# EasyEDA Pro project ProPrj_宽带运放系列_2025-07-18.epro

# Schematic Schematic1
Board Name: 反相放大器; Create Date: 2025-07-18; Page Name: P1; Project Name: 宽带运放系列; Schematic Name: Schematic1; Update Date: 2025-07-18; Company: 嘉立创EDA; Page Size: A4; Version: V1.0
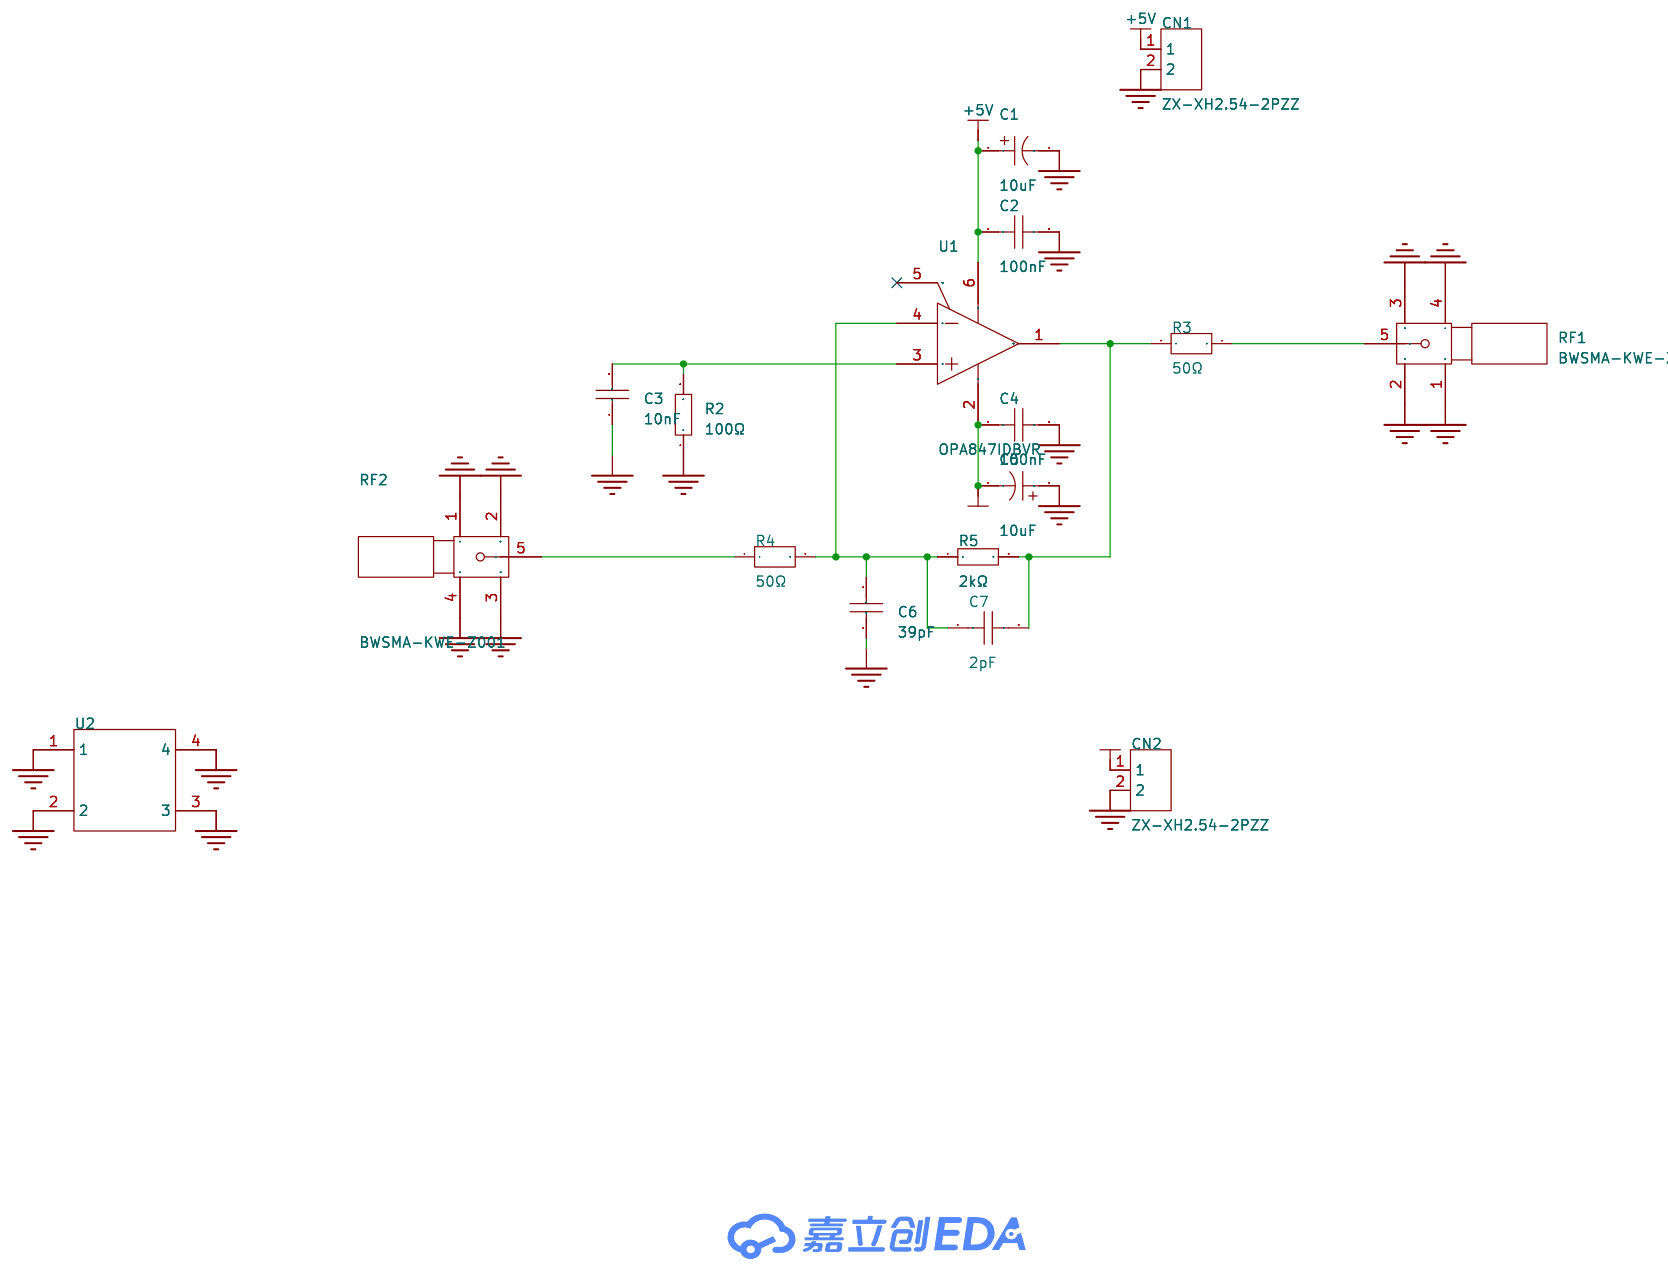
[diagram p0: schematic sheet]

## Parts
C1  10uF  [CAP-SMD_BD5.0-L5.3-W5.3-LS6.0-FD]
C2  100nF  [C0603]
C3  10nF  [C0603]
C4  100nF  [C0603]
C5  10uF  [CAP-SMD_BD5.0-L5.3-W5.3-LS6.0-FD]
C6  39pF  [C0603]
C7  2pF  [C0603]
CN1  ZX-XH2.54-2PZZ  [CONN-TH_2P-P2.50_HX25003-2A]
CN2  ZX-XH2.54-2PZZ  [CONN-TH_2P-P2.50_HX25003-2A]
R2  100Ω  [R0603]
R3  50Ω  [R0603]
R4  50Ω  [R0603]
R5  2kΩ  [R0603]
RF1  BWSMA-KWE-Z001  [SMA-TH_BWSMA-KWE-Z001]
RF2  BWSMA-KWE-Z001  [SMA-TH_BWSMA-KWE-Z001]
U1  OPA847IDBVR  [SOT-23-6_L2.9-W1.6-P0.95-LS2.8-BL]
U2  -  [22x17x6]

## Library data of the parts
C1 C5 = JVJ50v10M5x5: 容值:10uF;精度:±20%;额定电压:50V;纹波电流:18mA@120Hz;; LCSC Part Name: 10uF ±20% 50V; Supplier Part: C46550416; Manufacturer: 捷而瑞; Supplier Footprint: SMD,D5xL5.4mm; JLCPCB Part Class: 扩展库; Datasheet: https://atta.szlcsc.com/upload/public/pdf/source/20250526/372E583B5965CEB57A276EA554306514.pdf; Supplier: LCSC; Tolerance: ±20%; Voltage Rating: 50V; Ripple Current: 18mA@120Hz; Diameter: 5mm; Height - Seated (Max): 5.4mm; Lifetime: 2000hrs@105℃; Operating Temperature: -55℃~+105℃
C2 C4 = CC0603KRX7R9BB104: 容值:100nF;精度:±10%;额定电压:50V;温度系数:X7R;; LCSC Part Name: 100nF ±10% 50V; Supplier Part: C14663; Manufacturer: YAGEO(国巨); Supplier Footprint: 0603; JLCPCB Part Class: 基础库; Datasheet: https://atta.szlcsc.com/upload/public/pdf/source/20250214/096C4C206003071F5D32E5F0D8E7F8DF.pdf; Supplier: LCSC; Tolerance: ±10%; Voltage Rating: 50V; Temperature Coefficient: X7R
C3 = 0603B103K500NT: 容值:10nF;精度:±10%;额定电压:50V;温度系数:X7R;; LCSC Part Name: 10nF ±10% 50V; Supplier Part: C57112; Manufacturer: FH(风华); Supplier Footprint: 0603; JLCPCB Part Class: 基础库; Datasheet: https://atta.szlcsc.com/upload/public/pdf/source/20200305/C486355_26A10D38EF8C2A5C37091D0039909270.pdf; Supplier: LCSC; Tolerance: ±10%; Voltage Rating: 50V; Temperature Coefficient: X7R
C6 = CC0603JRNPO9BN390: 容值:39pF;精度:±5%;额定电压:50V;材质(温度系数):NP0;; LCSC Part Name: 39pF ±5% 50V; Supplier Part: C107049; Manufacturer: YAGEO(国巨); Supplier Footprint: 0603; JLCPCB Part Class: 扩展库; Datasheet: https://atta.szlcsc.com/upload/public/pdf/source/20170914/C128857_1505359892143968080.pdf; Supplier: LCSC; Tolerance: ±5%; Voltage Rated: 50V; Temperature Coefficient: NP0
C7 = CGA0603C0G2R0B500JT: 容值:2pF;额定电压:50V;温度系数:C0G;; LCSC Part Name: 2pF 50V; Supplier Part: C41361227; Manufacturer: HRE(芯声); Supplier Footprint: 0603; Datasheet: https://atta.szlcsc.com/upload/public/pdf/source/20240819/FD08B0507F9A1296548A8C715A0BDA69.pdf; Supplier: LCSC; Voltage Rating: 50V; Temperature Coefficient: C0G
CN1 CN2 = ZX-XH2.54-2PZZ: 插针结构:1x2P;间距:2.5mm;安装方式:直插;参考系列:XH;总PIN数:2P;排数:1;每排PIN数:2;行距:-;额定电流:3A;触头材质:黄铜;触头镀层:锡;工作温度:-25℃~+85℃;; LCSC Part Name: 1x2P 间距:2.5mm 直插 系列:XH; Supplier Part: C7429632; Manufacturer: Megastar(兆星); Supplier Footprint: 插件,P=2.5mm; JLCPCB Part Class: 扩展库; Datasheet: https://atta.szlcsc.com/upload/public/pdf/source/20230619/19BA6947230AA44A04D3EDD65E618FD0.pdf; Supplier: LCSC; Pins Structure: 1x2P; Pitch: 2.5mm; Mounting Type: 直插; Reference Series: XH; Number of Pins: 2P; Number of Rows: 1; Number of PINs Per Row: 2; Current Rating: 3A; Contact Material: 黄铜; Contact Plating: 锡; Operating Temperature: -25℃~+85℃; Voltage Rating: 250V; Plastic Material: PA66; Flame Retardant Rating: UL94V-0; Color: 白色; Z-Height of the Board: 7mm; X-Length of Bottom Edge on Board (Spacing Line): 7.5mm; Y-Width of Bottom Edge on Board: 5.9mm
R2 = 0603WAF1000T5E: 电阻类型:厚膜电阻;阻值:100Ω;精度:±1%;功率:100mW;最大工作电压:75V;温度系数:±200ppm/℃;; LCSC Part Name: 100Ω ±1% 100mW 厚膜电阻; Supplier Part: C22775; Manufacturer: UNI-ROYAL(厚声); Supplier Footprint: 0603; JLCPCB Part Class: 基础库; Datasheet: https://atta.szlcsc.com/upload/public/pdf/source/20200306/C422600_1E6D84923E4A46A82E41ADD87F860B5C.pdf; Supplier: LCSC; Type: 厚膜电阻; Tolerance: ±1%; Power(Watts): 100mW; Overload Voltage (Max): 75V; Temperature Coefficient: ±200ppm/℃; Operating Temperature Range: -55℃~+155℃
R3 R4 = RT0603BRE0750RL: 电阻类型:薄膜电阻;阻值:50Ω;精度:±0.1%;功率:100mW;温度系数:±50ppm/℃;; LCSC Part Name: 薄膜电阻 50Ω ±0.1% 100mW; Supplier Part: C849792; Manufacturer: YAGEO(国巨); Supplier Footprint: 0603; JLCPCB Part Class: 扩展库; Datasheet: https://atta.szlcsc.com/upload/public/pdf/source/20200610/C326738_5639A9F1B6EB6E4AE2197577D3456E7F.pdf; Supplier: LCSC; Type: 薄膜电阻; Tolerance: ±0.1%; Power(Watts): 100mW; Temperature Coefficient: ±50ppm/℃; Operating Temperature Range: -55℃~+155℃
R5 = 0603WAF2001T5E: 电阻类型:厚膜电阻;阻值:2kΩ;精度:±1%;功率:100mW;最大工作电压:75V;温度系数:±100ppm/℃;; LCSC Part Name: 2kΩ ±1% 100mW 厚膜电阻; Supplier Part: C22975; Manufacturer: UNI-ROYAL(厚声); Supplier Footprint: 0603; JLCPCB Part Class: 基础库; Datasheet: https://atta.szlcsc.com/upload/public/pdf/source/20200306/C422600_1E6D84923E4A46A82E41ADD87F860B5C.pdf; Supplier: LCSC; Type: 厚膜电阻; Tolerance: ±1%; Power(Watts): 100mW; Overload Voltage (Max): 75V; Temperature Coefficient: ±100ppm/℃; Operating Temperature Range: -55℃~+155℃
RF1 RF2 = BWSMA-KWE-Z001: 连接器类型:板端;接口类型:内孔;端口数量:1;接口直径:5.3mm;接口长度/高度:-;频率-最大值:-;射频系列:SMA;阻抗:50Ω;样式:弯头;触头材质:-;触头镀层:-;工作温度范围:-;焊接温度(最大值):-;; LCSC Part Name: 内孔 SMA 弯头; Supplier Part: C496551; Manufacturer: BAT WIRELESS(蝙蝠无线); Supplier Footprint: 插件; JLCPCB Part Class: 扩展库; Datasheet: https://atta.szlcsc.com/upload/public/pdf/source/20231017/997A8C2ADA7F8034A89BE1264F38CE52.pdf; Supplier: LCSC; Connector Type: 板端; Interface Type: 内孔; Number of Ports: 1; Interface Diameter: 5.3mm; RF Series: SMA; Impedance: 50Ω; Style: 弯头
U1 = OPA847IDBVR: 放大器数:单路;轨到轨:-;增益带宽积(GBP):3.9GHz;输入失调电压(Vos):500uV;压摆率(SR):950V/us;输入偏置电流(Ib):19uA;; Supplier Part: C160422; Manufacturer: TI(德州仪器); Supplier Footprint: SOT-23-6; JLCPCB Part Class: 扩展库; Datasheet: https://www.ti.com/cn/lit/gpn/opa847; Supplier: LCSC; Number of Circuits: 单路; Gain Bandwidth Product(GBP): 3.9GHz; Voltage - Input Offset(Vos): 500uV; Input Offset Voltage Drift (Vos TC): 1.5uV/℃; Slew Rate(SR): 950V/us; Current - Input Bias(Ib): 19uA; Noise density(eN): 0.85nV/√Hz@1MHz; Common Mode Rejection Ratio (CMRR): 110dB; Output Current: 100mA; Operating Temperature: -40℃~+85℃
U2 = 22x17x6

## Nets
+5V: C1.1 C2.1 CN1.1 U1.6(VS+)
-5V: C4.1 C5.2 CN2.1 U1.2(VS-)
GND: C1.2 C2.2 C3.1 C4.2 C5.1 C6.1 CN1.2 CN2.2 R2.1 RF1.1 RF1.2 RF1.3 RF1.4 RF2.1 RF2.2 RF2.3 RF2.4 U2.1 U2.2 U2.3 U2.4
Net-(C3-2): C3.2 R2.2 U1.3(IN+)
Net-(C6-2): C6.2 C7.1 R4.2 R5.1 U1.4(IN-)
Net-(C7-2): C7.2 R3.1 R5.2 U1.1(OUT)
Net-(R3-2): R3.2 RF1.5
Net-(R4-1): R4.1 RF2.5

Not connected (* = marked no-connect by the designer): U1 5(DIS)*

# Board PCB1
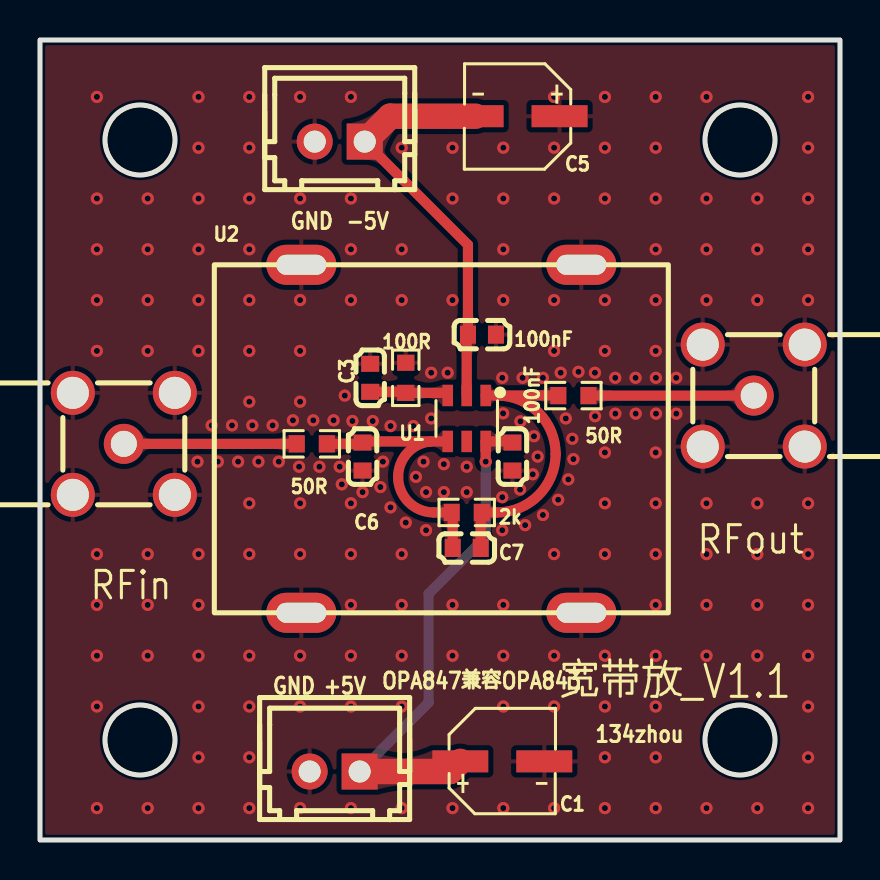
[diagram p1: board, top side]
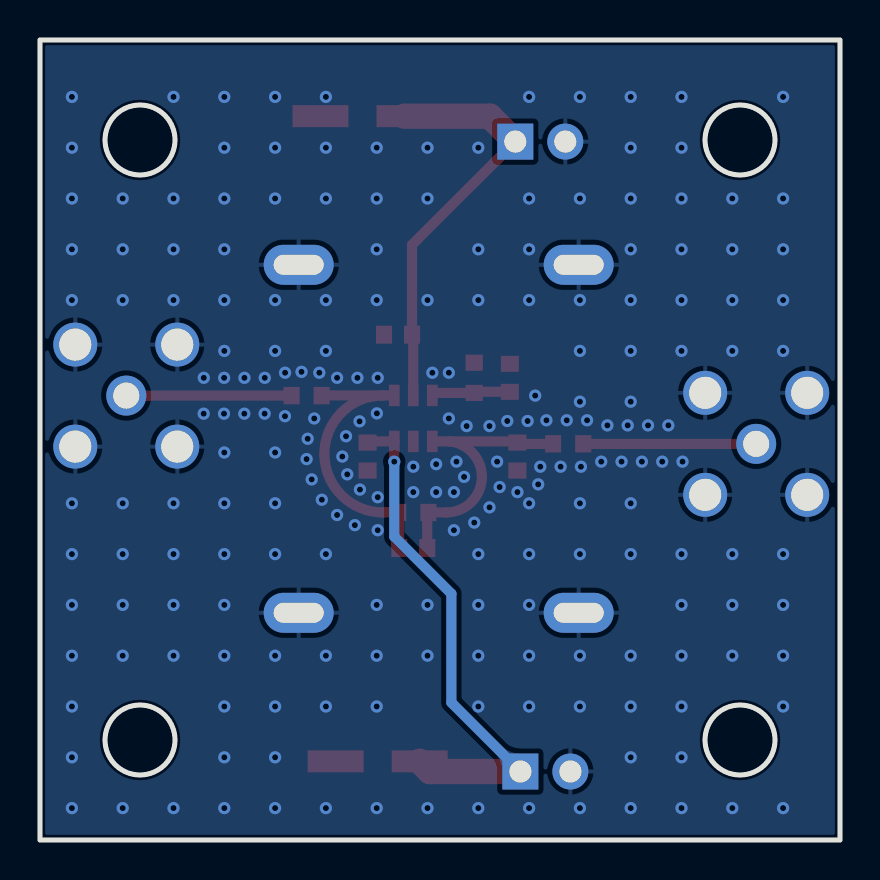
[diagram p2: board, bottom side, seen from below]

Outline 40 x 40 mm; copper layers: Top Layer, Bottom Layer. Coordinates in mm from the lower left corner of the outline.
Outline path: rectangle 0,40 40,0 ; circle c5,35 r1.75 ; circle c5,5 r1.75 ; circle c35,35 r1.75 ; circle c35,5 r1.75
Stack: Top Layer 0.035mm / Dielectric1 1.51mm FR4 er 4.5 / Bottom Layer 0.035mm

## Design rules (mm)
template: JLCPCB Capability(Two Layers Board)
spacing copperThickness1oz (default): track to track 0.102, other pairs 0.152 to 0.3
spacing copperThickness2oz: track to track 0.203, other pairs 0.152 to 0.3
track width copperThickness1oz (default): min 0.127, default 0.254, max 2.54
track width copperThickness2oz: min 0.203, default 0.254, max 2.54
differential pair differentialPair (default): width min 0.127, default 0.254, max 2.54; gap min 0.152, default 0.152
via viaSize (default): diameter min 0.5, default 0.61, max 10; hole min 0.3, default 0.305, max 6.3

## Placement (name value [footprint] x y rotation side)
2k  2kΩ  [R0603]  21.34 16.38 0 top
50R  -  [R0603]  26.67 22.22 0 top
50R#2  -  [R0603]  13.59 19.81 0 top
100nF  -  [C0603]  23.62 19.17 270 top
100nF#2  -  [C0603]  22.1 25.27 0 top
100R  100Ω  [R0603]  18.29 23.11 270 top
C1  10uF  [CAP-SMD_BD5.0-L5.3-W5.3-LS6.0-FD]  23.11 3.93 0 top
C3  10nF  [C0603]  16.51 23.11 270 top
C5  10uF  [CAP-SMD_BD5.0-L5.3-W5.3-LS6.0-FD]  23.88 36.19 180 top
C6  39pF  [C0603]  16.13 19.17 90 top
C7  2pF  [C0603]  21.34 14.6 0 top
CN1  ZX-XH2.54-2PZZ  [CONN-TH_2P-P2.50_HX25003-2A]  14.73 3.42 180 top
CN2  ZX-XH2.54-2PZZ  [CONN-TH_2P-P2.50_HX25003-2A]  14.99 34.92 180 top
RFin  BWSMA-KWE-Z001  [SMA-TH_BWSMA-KWE-Z001]  4.19 19.81 180 top
RFout  BWSMA-KWE-Z001  [SMA-TH_BWSMA-KWE-Z001]  35.69 22.22 0 top
U1  OPA847IDBVR  [SOT-23-6_L2.9-W1.6-P0.95-LS2.8-BL]  21.34 21.08 180 top
U2  -  [22x17x6]  20.07 20.06 0 top

## Footprints (pads in the part's own frame, mm; a bottom-side part is the same pattern mirrored in y, then rotated)
22x17x6
  oval 3.5x2 hole 2.5x1: 1(-7,-8.7) 2(7,-8.7) 3(7,8.7) 4(-7,8.7)
C0603
  rect 0.8x0.9 smd: 1(-0.7,0) 2(0.7,0)
CAP-SMD_BD5.0-L5.3-W5.3-LS6.0-FD
  rect 2.8x1.1 smd: 1(-2.1,0) 2(2.1,0)
CONN-TH_2P-P2.50_HX25003-2A
  rect 1.8x1.8 hole 1.1: 1(-1.25,0)
  round 1.8 hole 1.1: 2(1.25,0)
R0603
  rect 0.806x0.864 smd: 1(-0.753,0) 2(0.753,0)
SMA-TH_BWSMA-KWE-Z001
  round 2.2 hole 1.6: 1(-2.55,-2.55) 2(-2.55,2.55) 3(2.55,2.55) 4(2.55,-2.55)
  round 2 hole 1.3: 5(0,0)
SOT-23-6_L2.9-W1.6-P0.95-LS2.8-BL
  rect 0.532x1.072 smd: 1(-0.95,-1.149) 2(0,-1.149) 3(0.95,-1.149) 4(0.95,1.149) 5(0,1.149) 6(-0.95,1.149)

## Nets
+5V: 100nF.1 C1.1 CN1.1 U1.6
-5V: 100nF#2.1 C5.2 CN2.1 U1.2
GND: 100nF.2 100nF#2.2 100R.1 C1.2 C3.1 C5.1 C6.1 CN1.2 CN2.2 RFin.1 RFin.2 RFin.3 RFin.4 RFout.1 RFout.2 RFout.3 RFout.4 U2.1 U2.2 U2.3 U2.4
$1N446: 100R.2 C3.2 U1.3
$1N617: 2k.2 50R.1 C7.2 U1.1
$1N877: 50R#2.1 RFin.5
$1N931: 50R.2 RFout.5
$1N2133: 2k.1 50R#2.2 C6.2 C7.1 U1.4

Pads without a net: U1 5

## Via types
v1: diameter 0.61, hole 0.305, Top Layer to Bottom Layer, 217 vias

## Routing (per net, layer and track width the routed paths; a pad name or vN(x,y) marks a point on that pad's centre or on a via; arc(x,y) is an arc through that point)
+5V: length 25.7
  Top Layer w0.508: v1(22.29,18.92) U1.6 23.57,19.93 arc(23.61,19.91) 100nF.1
  Top Layer w1.27: C1.1 20.51,3.42 CN1.1
  Bottom Layer w0.508: v1(22.29,18.92) 22.29,15.17 19.43,12.31 19.43,6.87 CN1.1
-5V: length 20.9
  Top Layer w0.508: CN2.1 21.4,29.76 100nF#2.1 21.34,25.21 U1.2
  Top Layer w1.27: C5.2 17.51,36.19 CN2.1
GND:
  vias: v1(2.84,37.16) v1(2.84,32.08) v1(2.84,29.53) v1(2.84,27) v1(2.84,24.45) v1(2.84,14.3) v1(2.84,11.75) v1(2.84,9.22) v1(2.84,6.67) v1(2.84,1.59) v1(5.38,32.08) v1(5.38,29.53) v1(5.38,27) v1(5.38,24.45) v1(5.38,14.3) v1(5.38,11.75) v1(5.38,9.22) v1(5.38,1.59) v1(7.93,37.16) v1(7.93,34.61) v1(7.93,32.08) v1(7.93,29.53) v1(7.93,27) v1(7.93,24.45) v1(7.87,18.92) v1(7.93,14.3) v1(7.93,11.75) v1(7.93,9.22) v1(7.93,6.67) v1(7.93,4.14) v1(7.93,1.59) v1(8.58,20.73) v1(8.89,18.92) v1(9.6,20.73) v1(9.91,18.92) v1(10.47,37.16) v1(10.47,34.61) v1(10.47,32.08) v1(10.47,29.53) v1(10.47,27) v1(10.47,24.45) v1(10.47,21.92) v1(10.47,16.83) v1(10.47,14.3) v1(10.47,9.22) v1(10.47,6.67) v1(10.47,4.14) v1(10.47,1.59) v1(10.62,20.73) v1(10.92,18.92) v1(11.63,20.73) v1(11.94,18.92) v1(12.65,20.99) v1(13,37.16) v1(13,32.08) v1(13,27) v1(13,24.45) v1(13,21.92) v1(12.95,18.66) v1(13,16.83) v1(13,14.3) v1(13,9.22) v1(13,6.67) v1(13,1.59) v1(13.66,20.99) v1(13.97,18.66) v1(14.68,20.99) v1(14.99,18.66) v1(15.09,17.78) v1(15.24,22.22) v1(15.54,37.16) v1(15.54,32.08) v1(15.54,29.53) v1(15.54,27) v1(15.54,16.83) v1(15.54,14.3) v1(15.54,11.75) v1(15.54,9.22) v1(15.54,6.67) v1(15.54,1.59) v1(15.62,20.95) v1(16.13,17.39) v1(16.64,20.95) v1(17.02,17.65) v1(17.15,18.92) v1(17.53,20.7) v1(17.53,16.63) v1(18.09,34.61) v1(18.09,29.53) v1(18.09,27) v1(18.09,14.3) v1(18.09,11.75) v1(18.09,9.22) v1(18.09,6.67) v1(18.09,1.59) v1(18.29,15.87) v1(18.67,20.7) v1(18.8,18.16) v1(19.18,18.92) v1(19.3,17.39) v1(19.3,15.49) v1(19.56,23.36) v1(19.56,21.08) v1(20.19,18.79) v1(20.19,17.39) v1(20.38,23.36) v1(20.62,34.61) v1(20.62,32.08) v1(20.62,27) v1(20.62,11.75) v1(20.62,9.22) v1(20.62,1.59) v1(21.34,18.66) v1(21.34,17.39) v1(23.11,23.11) v1(23.11,17.14) v1(23.11,15.49) v1(23.16,34.61) v1(23.16,32.08) v1(23.16,29.53) v1(23.16,27) v1(23.16,21.33) v1(23.16,11.75) v1(23.16,9.22) v1(23.16,6.67) v1(23.16,1.59) v1(24.02,20.93) v1(24,17.52) v1(24.13,23.11) v1(24.26,15.74) v1(24.64,18.28) v1(24.7,20.19) v1(24.88,19.17) v1(25.15,23.11) v1(25.15,16.25) v1(25.71,37.16) v1(25.71,34.61) v1(25.71,32.08) v1(25.71,27) v1(25.71,24.45) v1(25.71,14.3) v1(25.71,9.22) v1(25.71,6.67) v1(25.71,1.59) v1(25.91,17.01) v1(26.03,23.36) v1(26.29,21.08) v1(26.42,18.03) v1(26.62,20.06) v1(26.67,19.05) v1(26.92,23.41) v1(27.75,23.36) v1(27.75,21.19) v1(28.25,37.16) v1(28.25,34.61) v1(28.25,32.08) v1(28.25,27) v1(28.25,24.45) v1(28.25,19.38) v1(28.25,16.83) v1(28.25,14.3) v1(28.25,9.22) v1(28.25,6.67) v1(28.25,4.14) v1(28.25,1.59) v1(28.76,23.11) v1(28.77,21.32) v1(29.78,23.11) v1(29.78,21.32) v1(30.78,37.16) v1(30.78,34.61) v1(30.78,32.08) v1(30.78,29.53) v1(30.78,27) v1(30.78,24.45) v1(30.79,23.11) v1(30.8,21.32) v1(30.78,19.38) v1(30.78,16.83) v1(30.78,14.3) v1(30.78,11.75) v1(30.78,9.22) v1(30.78,6.67) v1(30.78,4.14) v1(30.78,1.59) v1(31.81,23.11) v1(31.82,21.32) v1(33.32,37.16) v1(33.32,32.08) v1(33.32,29.53) v1(33.32,27) v1(33.32,16.83) v1(33.32,14.3) v1(33.32,11.75) v1(33.32,9.22) v1(33.32,1.59) v1(35.87,32.08) v1(35.87,29.53) v1(35.87,27) v1(35.87,16.83) v1(35.87,14.3) v1(35.87,11.75) v1(35.87,9.22) v1(35.87,1.59) v1(38.41,37.16) v1(38.41,34.61) v1(38.41,32.08) v1(38.41,29.53) v1(38.41,27) v1(38.41,16.83) v1(38.41,14.3) v1(38.41,11.75) v1(38.41,9.22) v1(38.41,6.67) v1(38.41,4.14) v1(38.41,1.59)
$1N446: length 4
  Top Layer w0.508: C3.2 18.23,22.41 arc(18.27,22.39) 100R.2 20.26,22.36 arc(20.35,22.32) U1.3
$1N617: length 15.4
  Top Layer w0.508: C7.2 22.04,16.32 arc(22.05,16.36) 2k.2 22.85,16.38 arc(24.92,17.24) 25.78,19.31 arc(24.93,21.37) 22.86,22.23 ; U1.1 22.86,22.23 ; 22.86,22.23 25.91,22.23 arc(25.91,22.22) 50R.1
$1N877: length 8.6
  Top Layer w0.508: RFin.5 50R#2.1
$1N931: length 8.3
  Top Layer w0.508: RFout.5 50R.2
$1N2133: length 14.2
  Top Layer w0.508: C7.1 20.64,16.32 arc(20.62,16.36) 2k.1 19.69,16.38 arc(18.43,16.9) 17.91,18.16 arc(18.38,19.36) 19.54,19.93 ; 19.54,19.93 16.19,19.93 arc(16.15,19.91) C6.2 16.06,19.81 50R#2.2 ; 19.54,19.93 U1.4

## Copper pours and planes (outline as drawn; the poured copper is in the pictures)
GND on Top Layer: 0,40.13 40,40.13 40,0.13 0,0.13
GND on Bottom Layer: 0,40 40,40 40,0 0,0

Small or netless copper shapes (teardrops, artwork), in the pictures only: 31 on Top Layer, 2 on Bottom Layer

## Text on the board
Top Silkscreen Layer: GND | -5V | 134zhou | +5V | OPA847兼容OPA843 | 宽带放_V1.1
